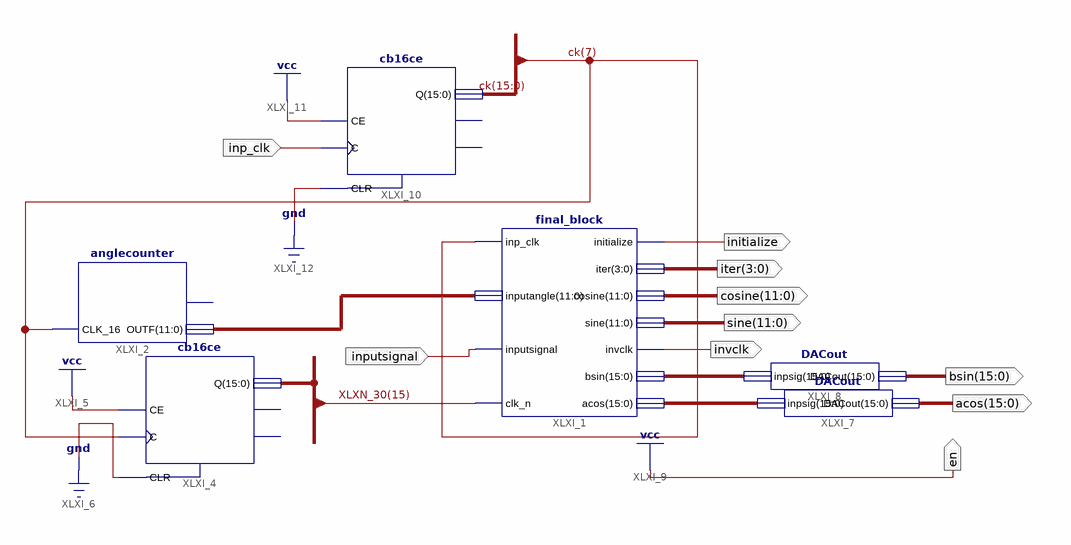
[diagram p0: schematic sheet 1]
// Xilinx ISE schematic Fial_Combine.sch (spartan3) as structural Verilog: 6 symbols, 10 ports
module Fial_Combine (
  input  inputsignal,
  input  inp_clk,
  output [11:0] sine,
  output [11:0] cosine,
  output [3:0] iter,
  output initialize,
  output invclk,
  output [15:0] bsin,
  output [15:0] acos,
  output en
);

  wire [11:0] XLXN_22;
  wire [15:0] ck, XLXN_30, XLXN_33, XLXN_34;

  anglecounter XLXI_2 (.CLK_16(ck[7]), .OUTF(XLXN_22));  // open: Quad_Change
  final_block XLXI_1 (
    .inp_clk(ck[7]), .inputangle(XLXN_22), .inputsignal(inputsignal), .clk_n(XLXN_30[15]),
    .initialize(initialize), .iter(iter), .cosine(cosine), .sine(sine), .invclk(invclk), .bsin(XLXN_33),
    .acos(XLXN_34));
  cb16ce XLXI_4 (.C(ck[7]), .CE(1'b1), .CLR(1'b0), .Q(XLXN_30));  // open: CEO, TC
  DACout XLXI_7 (.inpsig(XLXN_34), .DACout(acos));
  DACout XLXI_8 (.inpsig(XLXN_33), .DACout(bsin));
  cb16ce XLXI_10 (.C(inp_clk), .CE(1'b1), .CLR(1'b0), .Q(ck));  // open: CEO, TC

  assign en = 1'b1;
endmodule
